# Altium schematic sheet Charging_PCB.SchDoc
size A2; Organization: Altium Limited; Address1: L3, 12a Rodborough Rd; Address2: Frenchs Forest; Address3: NSW; Address4: Australia 2086
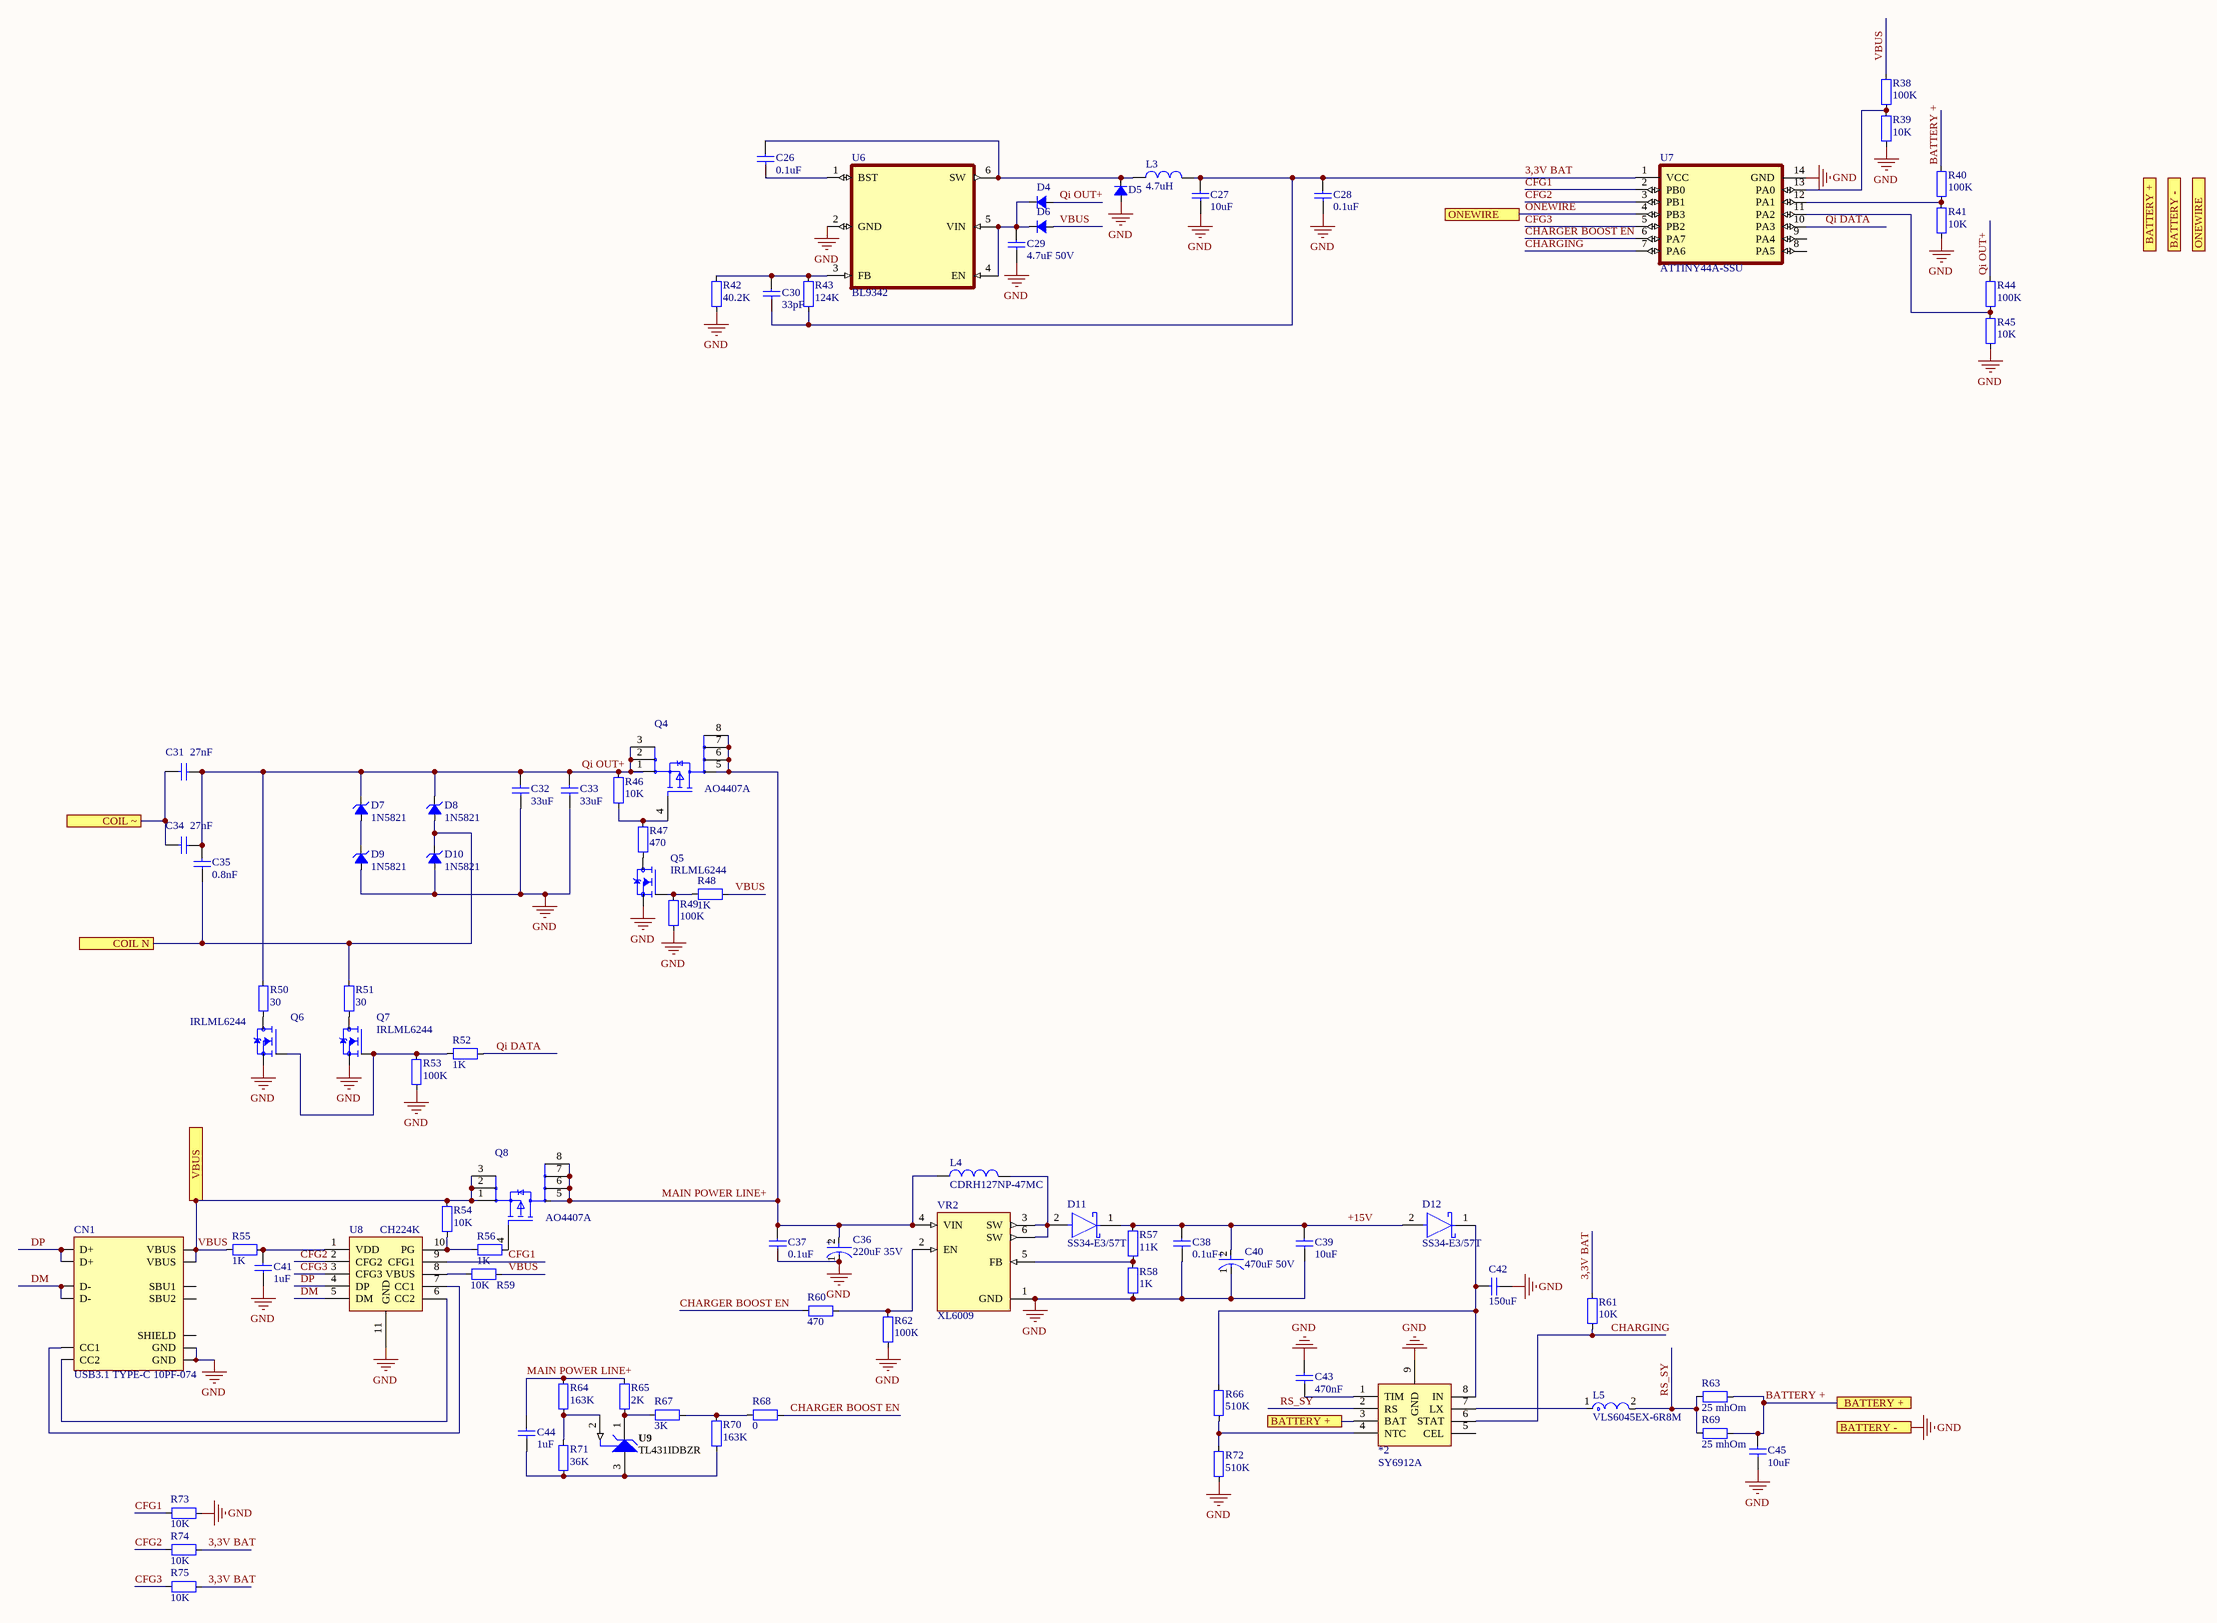
[diagram p0: Charging_PCB.SchDoc]

## Parts
*2  SY6912A  [SO8]
C26  0.1uF  [C0805]
C27  10uF  [C0805]
C28  0.1uF  [C0805]
C29  4.7uF 50V  [C0805]
C30  33pF  [C0805]
C31  27nF  [1206]
C32  33uF  [1206]
C33  33uF  [1206]
C34  27nF  [1206]
C35  0.8nF  [1206]
C36  220uF 35V  [FP-RAD-TH-D_8_0_5-L_15_1-MFG]
C37  0.1uF  [1206]
C38  0.1uF  [1206]
C39  10uF  [CAPC1005X04L]
C40  470uF 50V  [FP-RAD-TH-D_10_0_5-L_20_2-MFG]
C41  1uF  [1206]
C42  150uF  [CAPC1005X04L]
C43  470nF  [C0805]
C44  1uF  [1206]
C45  10uF  [CAPC1005X04L]
CN1  USB3.1 TYPE-C 10PF-074  [USB3.1 TYPE-C 10PF-074]
D4  (no value)  [SOD-123]
D5  (no value)  [SOD-123]
D6  (no value)  [SOD-123]
D7  1N5821  [DO201-vertical]
D8  1N5821  [DO201-vertical]
D9  1N5821  [DO201-vertical]
D10  1N5821  [DO201-vertical]
D11  SS34-E3/57T  [FP-95402-MFG]
D12  SS34-E3/57T  [FP-95402-MFG]
L3  4.7uH  [CDRH3D16NP]
L4  CDRH127NP-47MC  [SUMI-CDRH127_V]
L5  VLS6045EX-6R8M  [FP-VLS6045EX-100M-MFG]
Q4  AO4407A  [SOP-8_2-5R1S-IPC_B]
Q5  IRLML6244  [SOT-23]
Q6  IRLML6244  [SOT-23]
Q7  IRLML6244  [SOT-23]
Q8  AO4407A  [SOP-8_2-5R1S-IPC_B]
R38  100K  [C0805]
R39  10K  [C0805]
R40  100K  [C0805]
R41  10K  [C0805]
R42  40.2K  [C0805]
R43  124K  [C0805]
R44  100K  [C0805]
R45  10K  [C0805]
R46  10K  [C0805]
R47  470  [C0805]
R48  1K  [C0805]
R49  100K  [C0805]
R50  30  [1206]
R51  30  [1206]
R52  1K  [C0805]
R53  100K  [C0805]
R54  10K  [C0805]
R55  1K  [C0805]
R56  1K  [C0805]
R57  11K  [C0805]
R58  1K  [C0805]
R59  10K  [C0805]
R60  470  [C0805]
R61  10K  [C0805]
R62  100К  [C0805]
R63  25 mhOm  [1206]
R64  163K  [C0805]
R65  2K  [C0805]
R66  510K  [C0805]
R67  3K  [C0805]
R68  0  [C0805]
R69  25 mhOm  [1206]
R70  163K  [C0805]
R71  36K  [C0805]
R72  510K  [C0805]
R73  10K  [C0805]
R74  10K  [C0805]
R75  10K  [C0805]
U6  BL9342  [SOT50P160X60-6N]
U7  ATTINY44A-SSU  [SOIC127P600X175-14N]
U8  CH224K  [ESSOP10]
U9  TL431IDBZR  [SOT95P237X112-3N]
VR2  XL6009  [DPAK170P1435X465-6N]

## Ports
BATTERY +, BATTERY -, COIL N, COIL ~, ONEWIRE, VBUS

## Nets
GND: *2.9(GND) C27.1 C28.1 C29.1 C32.2 C33.2 C36.1(C) C37.1 C38.1 C39.1 C40.1(C) C41.1 C42.2 C43.2 C45.1 CN1.1(GND) CN1.12(GND) D5.1(A) D9.1(K) D10.1(K) Q5.2(S) Q6.2(S) Q7.2(S) R39.1 R41.1 R42.1 R45.1 R49.1 R53.1 R58.2 R62.2 R72.2 R73.2 U6.2(GND) U7.14(GND) U8.11(GND) VR2.1(GND) ; port BATTERY -
3,3V BAT: C27.2 C28.2 C30.1 L3.2 R43.1 R61.2 R74.2 R75.2 U7.1(VCC)
+15V: C38.2 C39.2 C40.2(A) D11.1(C) D12.2(A) R57.1
BATTERY +: *2.3(BAT) C45.2 R40.2 R63.2 R69.2 ; port BATTERY +
CFG1: R73.1 U7.2(PB0) U8.9(CFG1)
CFG2: R74.1 U7.3(PB1) U8.2(CFG2)
CFG3: R75.1 U7.5(PB2) U8.3(CFG3)
CHARGER BOOST EN: R60.2 R68.2 U7.6(PA7)
CHARGING: *2.6(STAT) R61.1 U7.7(PA6)
COIL N: C35.2 D8.1(K) D10.2(A) R51.2 ; port COIL N
COIL ~: C31.2 C34.2 ; port COIL ~
DM: CN1.6(D-) CN1.9(D-) U8.5(DM)
DP: CN1.4(D+) CN1.7(D+) U8.4(DP)
MAIN POWER LINE+: C36.2(A) C37.2 C44.2 L4.1 Q4.5(Drain) Q4.6(Drain) Q4.7(Drain) Q4.8(Drain) Q8.5(Drain) Q8.6(Drain) Q8.7(Drain) Q8.8(Drain) R64.2 R65.2 VR2.4(VIN)
ONEWIRE: U7.4(PB3) ; port ONEWIRE
Qi DATA: R52.2 U7.10(PA3)
Qi OUT+: C31.1 C32.1 C33.1 C34.1 C35.1 D4.1(A) D7.2(A) D8.2(A) Q4.1(Source) Q4.2(Source) Q4.3(Source) R44.2 R46.2 R50.2
RS_SY: *2.2(RS) L5.2 R63.1 R69.1
VBUS: CN1.3(VBUS) CN1.10(VBUS) D6.1(A) Q8.1(Source) Q8.2(Source) Q8.3(Source) R38.2 R48.2 R54.2 R55.1 R59.2 ; port VBUS
Net*2_1: *2.1(TIM) C43.1
Net*2_4: *2.4(NTC) R66.2 R72.1
Net*2_7: *2.7(LX) L5.1
Net*2_8: *2.8(IN) C42.1 D12.1(C) R66.1
NetC26_1: C26.1 U6.1(BST)
NetC26_2: C26.2 D5.2(K) L3.1 U6.6(SW)
NetC29_2: C29.2 D4.2(K) D6.2(K) U6.4(EN) U6.5(VIN)
NetC30_2: C30.2 R42.2 R43.2 U6.3(FB)
NetC41_2: C41.2 R55.2 U8.1(VDD)
NetC44_1: C44.1 R70.1 R71.1 U9.3(ANODE)
NetCN1_2: CN1.2(CC1) U8.7(CC1)
NetCN1_8: CN1.8(CC2) U8.6(CC2)
NetD7_1: D7.1(K) D9.2(A)
NetD11_2: D11.2(A) L4.2 VR2.3(SW) VR2.6(SW)
NetQ4_4: Q4.4(Gate) R46.1 R47.2
NetQ5_1: Q5.1(G) R48.1 R49.2
NetQ5_3: Q5.3(D) R47.1
NetQ6_1: Q6.1(G) Q7.1(G) R52.1 R53.2
NetQ6_3: Q6.3(D) R50.1
NetQ7_3: Q7.3(D) R51.1
NetQ8_4: Q8.4(Gate) R56.2
NetR38_1: R38.1 R39.2 U7.13(PA0)
NetR40_1: R40.1 R41.2 U7.12(PA1)
NetR44_1: R44.1 R45.2 U7.11(PA2)
NetR54_1: R54.1 R56.1 U8.10(PG)
NetR57_2: R57.2 R58.1 VR2.5(FB)
NetR59_1: R59.1 U8.8(VBUS)
NetR60_1: R60.1 R62.1 VR2.2(EN)
NetR64_1: R64.1 R71.2 U9.2(REF)
NetR65_1: R65.1 R67.1 U9.1(CATHODE)
NetR67_2: R67.2 R68.1 R70.2

Not connected (* = marked no-connect by the designer): *2 5(CEL); CN1 5(SBU2) 11(SBU1) MH(SHIELD); U7 8(PA5) 9(PA4)

## Notes on the sheet
- Title
- Size:
- Date:
- File:
- A2
- Number:
- Time:
- Revision:
- Sheet
- of
- (in symbol CAP 10x20) +
- (in symbol CMP-05427-000678-1) +

## Library data of the parts
C26-C35 C37-C39 C41-C45 = CAP
  C26 C28 C37 C38: Value: 0.1uF
  C27 C39 C45: Value: 10uF
  C29: Value: 4.7uF 50V
  C30: Value: 33pF
  C31 C34: Value: 27nF
  C32 C33: Value: 33uF
  C35: Value: 0.8nF
  C41 C44: Value: 1uF
  C42: Value: 150uF
  C43: Value: 470nF
C36 = CMP-05427-000678-1: Aluminum Electrolytic Capacitors (Radial Lead Type) 220uF ±20% 35V; Ripple Current: 1.24A; Impedance: 41mR; Lead Length: 17mm; Life (Hours): 3000Hour; Lead Diameter: 0.6mm; Dielectric Material: Aluminium; Dissipation Factor: 0.12%; Package Quantity: 200; Tolerance: 20%; Series: FM; Voltage Rating: 35V; Lead Pitch: 3.5mm; Radiation Hardening: No; Construction: RADIAL; RoHS Compliant: Yes; REACH SVHC: Yes; Lead Free: Lead Free; Height - Seated (Max): 0.65inch; Length: 15mm; Diameter: 8mm; Mount: Through Hole; Number of Pins: 2; Height: 15mm; Voltage: 35V; Case/Package: Radial; Packaging: Bulk; Min Operating Temperature: -40°C; Voltage Rating (DC): 35V; ESR (Equivalent Series Resistance): 41mR; Capacitance: 220uF; Max Operating Temperature: 105°C; Termination: Radial
C40 = CAP 10x20: Aluminum Electrolytic Capacitors (Radial Lead Type) 10uF ±20% 400V; Lead/Base Style: Straight; Lead Diameter: 0.6mm; Dissipation Factor: 0.24%; Ripple Current (AC): 80mA; Life (Hours): 2000Hour; Polarity: Polar; Dielectric Material: Aluminium; Lead Free: Lead Free; Capacitance: 10uF; Tolerance: 20%; Height: 20mm; Number of Pins: 2; Case/Package: Radial; Package Quantity: 200; REACH SVHC: No SVHC; Termination: Radial; Radiation Hardening: No; Diameter: 10mm; RoHS Compliant: Yes; Construction: RADIAL; Max Operating Temperature: 105°C; Voltage Rating: 400V; Mount: Through Hole; Voltage: 400V; Height - Seated (Max): 0.866inch; Lead Pitch: 5mm; Voltage Rating (DC): 400V; Contact Plating: Tin; Length: 20mm; Series: NHG; Min Operating Temperature: -25°C; Packaging: Bulk; Ripple Current: 80mA
CN1 = USB3.1 TYPE-C 10PF-074: XKB Connectivity USB-C Connector
D4-D6 = Diode_SOD123: Schottky diode SOD123; Note: Schottky diode  SOD123
D7-D10 = Diode_Shottki_DO201V: DO201; Manufacturer Part Number: China; Note: 1N5821; Value: 1N5821
D11 D12 = SS34: DIODE SCHOTTKY 40V 3A DO214AB; Manufacturer: Vishay; Max Junction Temp: +150°C; Peak Reverse Current: 0.5mA; Max Surge Forward Current: 100A; Standoff Height: 0mm; ComponentLink2Description: Datasheet; Device Class L3: Schottky Diodes; Height: 2.62mm; Max Repetitive Reverse Voltage: 40V; Lead Free: Yes; Package: 95402; Temperature Range High: +150°C; ComponentLink2URL: http://www.vishay.com/docs/88751/ss32.pdf; Temperature: -55°C to +150°C; Footprint Url: http://www.vishay.com/docs/95402/smc.pdf; Automotive: No; Forward Current: 3A; Category: Diode; Manufacturer Part Number: SS34-E3/57T; RoHS: TRUE; Device Class L2: Diodes; Mouser Description: Schottky Diodes & Rectifiers 3.0 Amp 40 Volt; Octopart: https://octopart.com/ss34-e3%2F57t-vishay-39552907; Temperature Range Low: -55°C; Device Class L1: Discrete Semiconductors; Digikey Description: DIODE SCHOTTKY 40V 3A DO214AB
L3 = CDRH3D16NP: 4,7µH Shielded Inductor 900mA 140mOhm Max Nonstandard; Manufacturer: Sumida; Manufacturer Part Number: CDRH3D16NP-100NC; Note: 4.7µH Shielded Inductor 550mA 140mOhm; Value: 4.7uH
L4 = CMP-2000-06084-1: Power Inductor, 10 uH, +/- 20%, -40 to 100 degC, 2-Pin SMD, RoHS, Tape and Reel; Manufacturer: Sumida; Catalog Drawings: CDRH127SeriesFrontCDRH127SeriesSideCDRH127SeriesBottom; Product Training Modules: PowerInductorBasics; Shielding: Shielded; Online Catalog: CDRHSeries; DC Resistance (DCR): 21.6mOhmMax; Other Names: 308-1457-1; Frequency - Test: 1kHz; Mounting Type: SurfaceMount; Datasheet Version: 01/2014; Package Description: 2-Pin Surface Mount Device, Body 12 x 12 mm; Frequency - Self Resonant: -; Package Reference: CDRH127; Category: Inductors,Coils,Chokes; Material - Core: -; Q @ Freq: -; Type: -; Family: FixedInductors; Ratings: -; Series: CDRH127; Manufacturer URL: http://www.sumida.com/; Operating Temperature: -40°C~100°C; Height - Seated (Max): 0.315"(8.00mm); Standard Package: 1; Size / Dimension: 0.472"Lx0.472"W(12.00mmx12.00mm); Current - Saturation: -; Datasheet URL: http://products.sumida.com/products/pdf/CDRH127.pdf; Package / Case: Nonstandard; Tolerance: ±20%; Mounting Technology: SurfaceMount; Packaging: CutTape(CT)
L5 = VLS6045EX: FIXED IND  SMD; Shielding: Shielded; Test Frequency: 100kHz; Core Material: Ferrite; Inductance Tolerance: 20%; DC Resistance (DCR): 61mR; REACH SVHC: No SVHC; Min Operating Temperature: -40°C; RoHS Compliant: Yes; Length: 0.236inch; Lead Free: Lead Free; Packaging: Cut Tape; Width: 0.236inch; Case/Package: Nonstandard; Resistor Type: Wirewound; Height - Seated (Max): 0.177inch; Mount: Surface Mount; Max Operating Temperature: 105°C; Tolerance: 20%
Q4 Q8 = MOSFET P-CH 30V 9A 8SOP: Rise Time: 8ns; Input Capacitance: 1.65nF; Fall Time: 42ns; Rds On Max: 22mR; Gate to Source Voltage (Vgs): 20V; Number of Pins: 8; Packaging: Tape and Reel; Mount: Surface Mount; Radiation Hardening: No; Continuous Drain Current (ID): 9A; Series: -; Package Quantity: 2500; Drain to Source Voltage (Vdss): 30V; Case/Package: SOIC; Max Operating Temperature: 150°C; Min Operating Temperature: -55°C
Q5-Q7 = IRLML6244: MOSFET P-CH 30V 3.6A SOT-23-3; MF: {'manufacturer': u'Infineon Technologies'}; MP: IRLML9301TRPBF; Package: None; Price: None; Value: *; Availability: Unavailable
R38-R75 = RES SMD UNI: Resistor SMD; Category: Resistors
  R38 R40 R44 R49 R53: Value: 100K
  R39 R41 R45 R46 R54 R59 R61 R73-R75: Value: 10K
  R42: Value: 40.2K
  R43: Value: 124K
  R47 R60: Value: 470
  R48 R52 R55 R56 R58: Value: 1K
  R50 R51: Value: 30
  R57: Value: 11K
  R62: Value: 100К
  R63 R69: Value: 25 mhOm
  R64 R70: Value: 163K
  R65: Value: 2K
  R66 R72: Value: 510K
  R67: Value: 3K
  R68: Value: 0
  R71: Value: 36K
U6 = BL9342: MF: {'manufacturer': u'Texas Instruments'}; Package: None; MP: BL9342; Value: *; Price: None; Availability: Unavailable
U7 = ATTINY44A-SSU: MF: {'manufacturer': u'Microchip'}; Package: None; Value: *; Price: None; MP: ATTINY44A-SSU; Availability: Unavailable
U8 = CH224K: IC PD QC USB driver; Manufacturer: ST; Manufacturer Part Number: ST3485EBDR; Note: IC TXRX 3.3V RS485/422 8 SOIC
U9 = TL431IDBZR: Adjustable Precision Shunt Regulator, 34 ppm / degC, 100 mA, -40 to 85 degC, 3-pin SOT-23 (DBZ), Green (RoHS & no Sb/Br); Manufacturer: Texas Instruments; VO Adj(Max)(V): 36; VO Adj(Min)(V): 2.495; Temp Coeff(Max)(ppm/ degree C): 92; Iout/Iz(Max)(mA): 100; Temp Coeff(Typ)(ppm/ degree C): 34; Rating: Military; Initial Accuracy @ 25/deg C(%): 2; SubFamily: Shunt Voltage Reference; Min Iz for Regulation(uA): 600; Eco-Plan: Green (RoHS & no Sb/Br); ComponentLink3URL: http://www.ti.com/litv/pdf/mpds108a; ComponentLink3Description: Package Specification; ComponentLink1Description: Manufacturer URL; Code_JEDEC: TO-236; PartNumber: TL431IDBZR; PackageReference: DBZ0003A; ComponentLink1URL: http://www.ti.com/; ComponentLink2URL: http://www.ti.com/general/docs/lit/getliterature.tsp?genericPartNumber=TL431&fileType=pdf; DatasheetVersion: SLVS543M; ComponentLink2Description: Datasheet; PackageVersion: 4203227/B; Mounting Technology: Surface Mount; PackageDescription: 3-Pin Plastic Small Outline, Body 2.92 x 1.3 mm, Pitch 0.95 mm
VR2 = XL6009: The XL6009 regulator is a wide input range, current mode, DC/DC converter which is capable of generating either positive or negative output voltages.; MF: {'manufacturer': u'XLSEMI'}; Price: None; Package: None; Availability: Unavailable; Value: *; MP: XL6009